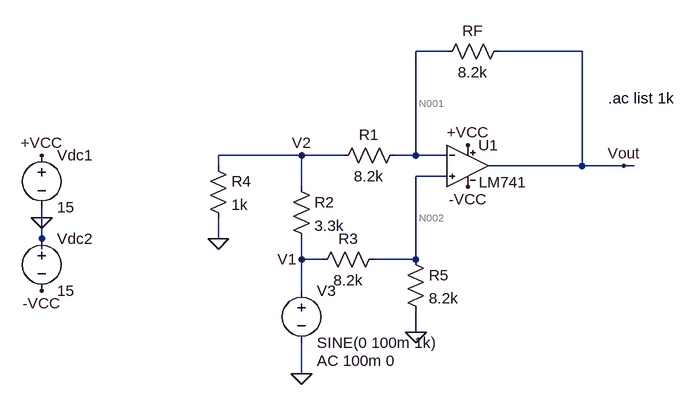
[diagram p0: schematic Subtractor.asc]
Subtractor.asc, the LTspice schematic file:
Version 4
SHEET 1 880 680
WIRE 208 -64 160 -64
WIRE 416 -64 288 -64
WIRE -16 96 -144 96
WIRE 48 96 -16 96
WIRE 160 96 160 -64
WIRE 160 96 128 96
WIRE 208 96 160 96
WIRE -144 112 -144 96
WIRE 416 112 416 -64
WIRE 416 112 272 112
WIRE 480 112 416 112
WIRE 496 112 480 112
WIRE 208 128 160 128
WIRE -16 144 -16 96
WIRE -416 192 -416 176
WIRE -416 224 -416 192
WIRE -144 224 -144 192
WIRE -416 240 -416 224
WIRE -16 256 -16 224
WIRE 16 256 -16 256
WIRE 160 256 160 128
WIRE 160 256 96 256
WIRE -16 304 -16 256
WIRE 160 368 160 336
WIRE -16 432 -16 384
FLAG -416 96 +VCC
FLAG 240 80 +VCC
FLAG 480 112 Vout
FLAG -416 304 -VCC
FLAG 240 144 -VCC
FLAG -416 192 0
FLAG 160 368 0
FLAG -16 432 0
FLAG -16 96 V2
FLAG -16 256 V1
FLAG -144 224 0
SYMBOL LM741 240 48 R0
SYMATTR InstName U1
SYMBOL voltage -416 80 R0
WINDOW 123 0 0 Left 0
WINDOW 39 0 0 Left 0
SYMATTR InstName Vdc1
SYMATTR Value 15
SYMBOL voltage -416 208 R0
WINDOW 123 0 0 Left 0
WINDOW 39 0 0 Left 0
SYMATTR InstName Vdc2
SYMATTR Value 15
SYMBOL res 144 80 R90
WINDOW 0 0 56 VBottom 2
WINDOW 3 32 56 VTop 2
SYMATTR InstName R1
SYMATTR Value 8.2k
SYMBOL res 304 -80 R90
WINDOW 0 0 56 VBottom 2
WINDOW 3 32 56 VTop 2
SYMATTR InstName RF
SYMATTR Value 8.2k
SYMBOL res -32 128 R0
WINDOW 0 36 40 Left 2
WINDOW 3 36 76 Left 2
SYMATTR InstName R2
SYMATTR Value 3.3k
SYMBOL res 144 240 R0
WINDOW 0 36 40 Left 2
WINDOW 3 36 76 Left 2
SYMATTR InstName R5
SYMATTR Value 8.2k
SYMBOL res 112 240 R90
WINDOW 0 0 56 VBottom 2
WINDOW 3 32 56 VTop 2
SYMATTR InstName R3
SYMATTR Value 8.2k
SYMBOL res -160 96 R0
WINDOW 0 36 40 Left 2
WINDOW 3 36 76 Left 2
SYMATTR InstName R4
SYMATTR Value 1k
SYMBOL voltage -16 288 R0
WINDOW 123 24 124 Left 2
WINDOW 39 0 0 Left 0
SYMATTR Value2 AC 100m 0
SYMATTR InstName V3
SYMATTR Value SINE(0 100m 1k)
TEXT 456 8 Left 2 !.ac list 1k

The netlist it stands for:
* Subtractor.asc
XU1 N002 N001 +VCC -VCC Vout LM741  ; pins In+ In- V+ V- OUT
Vdc1 +VCC 0 15
Vdc2 0 -VCC 15
R1 N001 V2 8.2k
RF Vout N001 8.2k
R2 V2 V1 3.3k
R5 N002 0 8.2k
R3 N002 V1 8.2k
R4 V2 0 1k
V3 V1 0 SINE(0 100m 1k) AC 100m 0
.ac list 1k
.lib LM741.lib
.backanno
.end

* Results of the author's LTspice run, read from the files saved beside the schematic
* Operating Point, zero values left out:
*   V(n001) = 762.8 µV
*   V(n002) = -237.2 µV
*   V(-vcc) = -15 V
*   V(+vcc) = 15 V
*   V(vout) = 2.296 mV
*   V(v2) = 65.28 µV
*   I(R4) = 65.28 nA
*   I(R3) = -28.93 nA
*   I(R5) = -28.93 nA
*   I(R2) = 19.78 nA
*   I(Rf) = 186.9 nA
*   I(R1) = 85.06 nA
*   I(V3) = -9.147 nA
*   I(Vdc2) = -1.701 mA
*   I(Vdc1) = -1.701 mA
*   Ix(u1:1) = 57.86 nA
*   Ix(u1:2) = 101.9 nA
*   Ix(u1:99) = 1.701 mA
*   Ix(u1:50) = -1.701 mA
*   Ix(u1:28) = -186.9 nA
* AC Analysis:
*   frequency = 1 k
*   V(n001) = 50 mV
*   V(n002) = 50 mV
*   V(-vcc) = 0 V
*   V(+vcc) = 0 V
*   V(vout) = 74.46 mV
*   V(v2) = 25.54 mV
*   V(v1) = 100 mV
*   I(R4) = 25.54 µA
*   I(R3) = -6.098 µA
*   I(R5) = 6.098 µA
*   I(R2) = -22.56 µA
*   I(Rf) = 2.982 µA
*   I(R1) = 2.982 µA
*   I(V3) = -28.66 µA
*   I(Vdc2) = 1.49 µA
*   I(Vdc1) = -1.493 µA
*   Ix(u1:1) = -1.412 pA
*   Ix(u1:2) = 1.512 pA
*   Ix(u1:99) = 1.493 µA
*   Ix(u1:50) = 1.49 µA
*   Ix(u1:28) = -2.982 µA